# EAGLE design RF Breakout Boards (EAGLE 9.5.1)
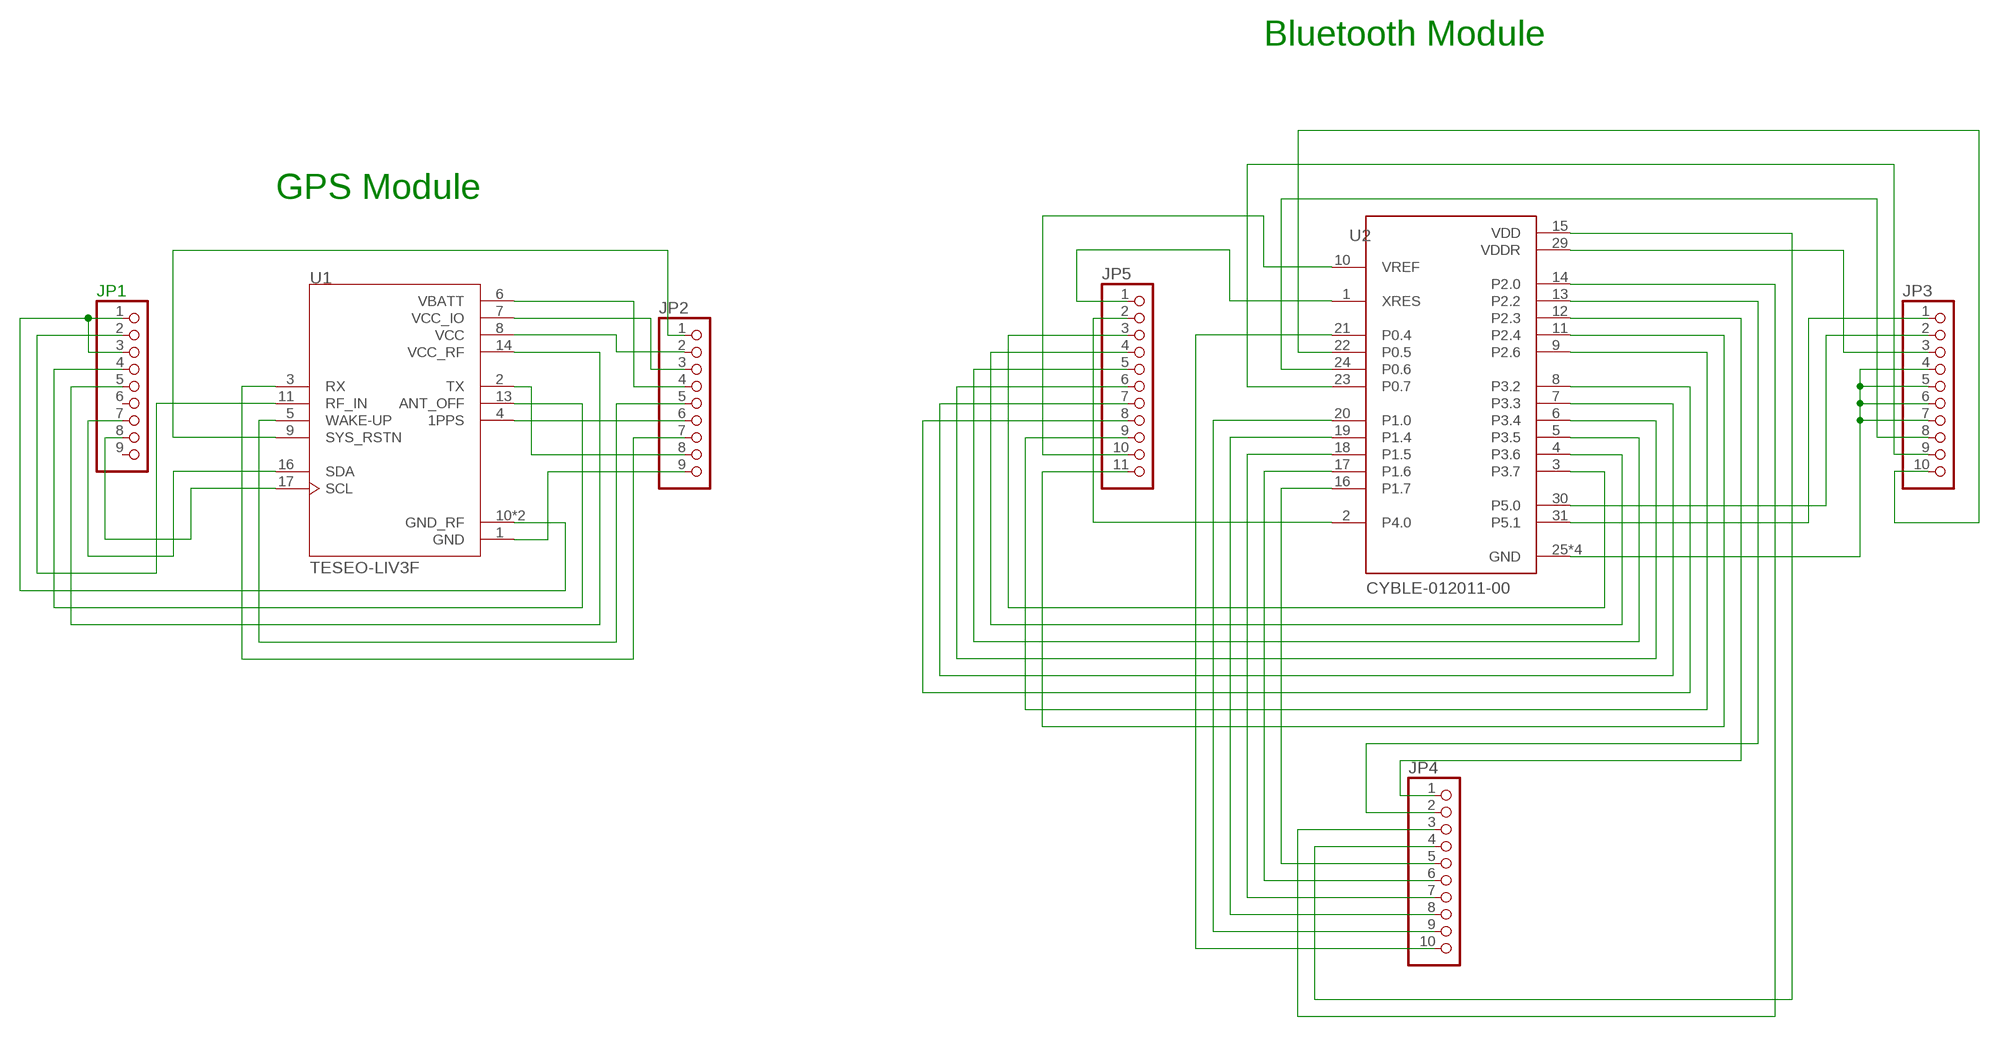
[diagram p0: schematic, sheet 1]

## Parts
JP1  PINHD-1X9  [1X09]
JP2  PINHD-1X9  [1X09]
JP3  PINHD-1X10  [1X10]
JP4  PINHD-1X10  [1X10]
JP5  PINHD-1X11  [1X11]
U1  TESEO-LIV3F  [TESEO-LIV3F]
U2  CYBLE-012011-00  [XCVR_CYBLE-012011-00]

## Nets
1PPS: JP2.6 U1.4(1PPS)
ANT_OFF: JP1.4 U1.13(ANT_OFF)
GND: JP2.9 U1.1(GND)
GND2: JP3.4 JP3.5 JP3.6 JP3.7 U2.25(GND) U2.26(GND) U2.27(GND) U2.28(GND)
GND_RF: JP1.1 JP1.3 U1.10(GND_RF) U1.12(GND_RF)
P0.4: JP4.10 U2.21(P0.4)
P0.5: JP3.10 U2.22(P0.5)
P0.6: JP3.8 U2.24(P0.6)
P0.7: JP3.9 U2.23(P0.7)
P1.0: JP4.9 U2.20(P1.0)
P1.4: JP4.8 U2.19(P1.4)
P1.5: JP4.7 U2.18(P1.5)
P1.6: JP4.6 U2.17(P1.6)
P1.7: JP4.5 U2.16(P1.7)
P2.0: JP4.3 U2.14(P2.0)
P2.2: JP4.2 U2.13(P2.2)
P2.3: JP4.1 U2.12(P2.3)
P2.4: JP5.11 U2.11(P2.4)
P2.6: JP5.9 U2.9(P2.6)
P3.2: JP5.8 U2.8(P3.2)
P3.3: JP5.7 U2.7(P3.3)
P3.4: JP5.6 U2.6(P3.4)
P3.5: JP5.5 U2.5(P3.5)
P3.6: JP5.4 U2.4(P3.6)
P3.7: JP5.3 U2.3(P3.7)
P4.0: JP5.2 U2.2(P4.0)
P5.0: JP3.2 U2.30(P5.0)
P5.1: JP3.1 U2.31(P5.1)
RF_IN: JP1.2 U1.11(RF_IN)
RX: JP2.7 U1.3(RX)
SCL: JP1.8 U1.17(SCL)
SDA: JP1.7 U1.16(SDA)
SYS_RSTN: JP2.1 U1.9(SYS_RSTN)
TX: JP2.8 U1.2(TX)
VBATT: JP2.4 U1.6(VBATT)
VCC: JP2.2 U1.8(VCC)
VCC_IO: JP2.3 U1.7(VCC_IO)
VCC_RF: JP1.5 U1.14(VCC_RF)
VDD: JP4.4 U2.15(VDD)
VDDR: JP3.3 U2.29(VDDR)
VREF: JP5.10 U2.10(VREF)
WAKE-UP: JP2.5 U1.5(WAKE-UP)
XRES: JP5.1 U2.1(XRES)
Unconnected: JP1.6 JP1.9

## Notes on the sheet
- Bluetooth Module
- GPS Module

## Library data of the parts
JP1 JP2 = pinhead:PINHD-1X9: PIN HEADER
JP3 JP4 = pinhead:PINHD-1X10: PIN HEADER
JP5 = pinhead:PINHD-1X11: PIN HEADER
U1 = TESEO-LIV3F:TESEO-LIV3F: Link: https://www.st.com/en/positioning/teseo-liv3f.html; AVAILABILITY: Unavailable; DESCRIPTION: - RF Receiver BeiDou, Galileo, GLONASS, GNSS, GPS 1.575GHz -163dBm 18-LCC _9.7x10.1_; MF: STMicroelectronics; MP: TESEO-LIV3F; PACKAGE: SMD-18 STMicroelectronics; PRICE: None
U2 = CYBLE-012011-00:CYBLE-012011-00: Bluetooth Bluetooth v4.1 Transceiver Module 2.4GHz ~ 2.48GHz Integrated, Trace Surface Mount; AVAILABILITY: Unavailable; DESCRIPTION: Bluetooth Bluetooth v4.1 Transceiver Module 2.4GHz ~ 2.48GHz Integrated, Trace Surface Mount; MF: Cypress Semiconductor; MP: CYBLE-012011-00; PACKAGE: Module Cypress Semiconductor; PRICE: None

## Board
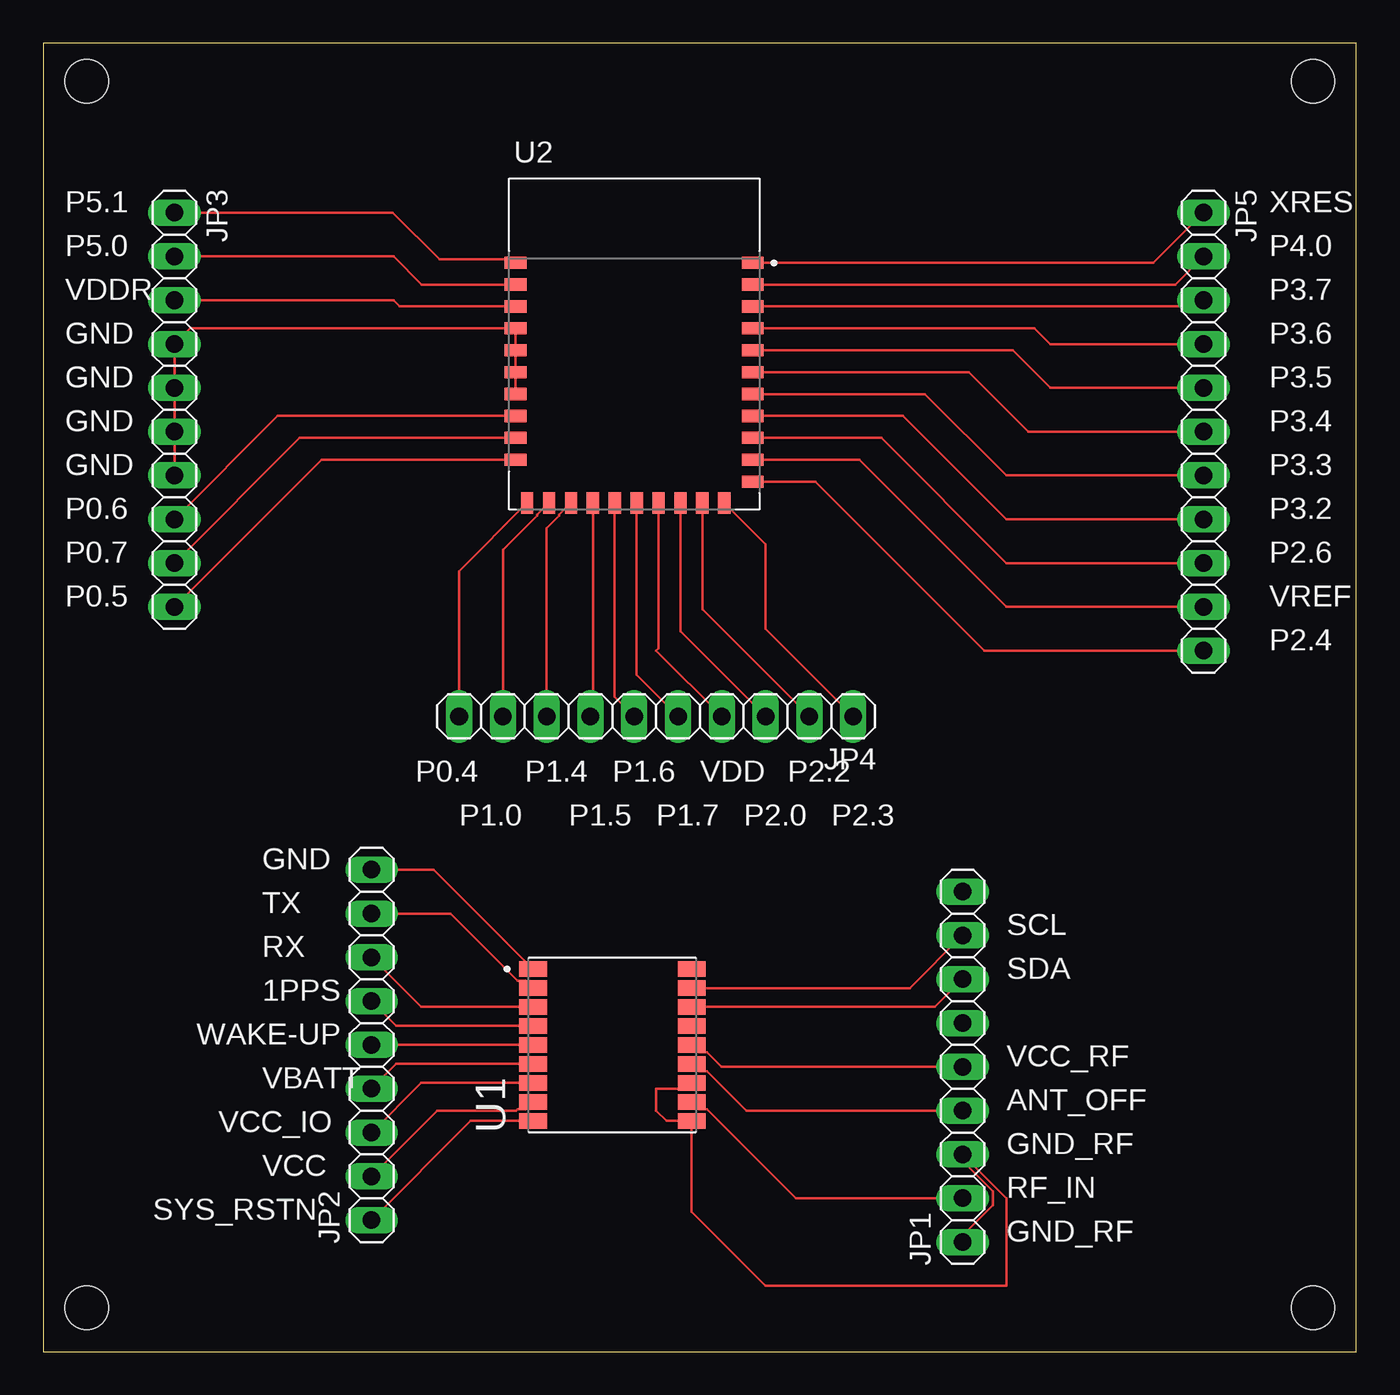
[diagram p1: board, top side]

Size 76.18 x 75.87 mm. Coordinates in mm from the lower left corner, seen from the top.
Outline: 0,0 76.18,0 76.18,75.87 0,75.87 0,0
Copper layers (1*16): Top 0.035mm / dielectric 1.5mm / Bottom 0.035mm
Design rules "default": minimum track width 6mil, minimum drill 0.35mm, track to track 6mil, track to pad 6mil, pad to pad 6mil, via to via 6mil, smd to smd 6mil, copper to edge 40mil, drill to drill 6mil, minimum pad ring 10mil, minimum via ring 8mil, stop-mask expansion 4mil, vias tented up to drill 0mil, thermal gap 10mil
Holes 2.5 mm at 2.54,73.66 2.54,2.54 73.66,2.54 73.66,73.66

### Footprints (pad centres in the part's own frame; a part is rotated, then mirrored left to right if it is on the bottom)
1X09 = drill 1.016 long: 1 -10.16,0; 2 -7.62,0; 3 -5.08,0; 4 -2.54,0; 5 0,0; 6 2.54,0; 7 5.08,0; 8 7.62,0; 9 10.16,0
1X10 = drill 1.016 long: 1 -11.43,0; 2 -8.89,0; 3 -6.35,0; 4 -3.81,0; 5 -1.27,0; 6 1.27,0; 7 3.81,0; 8 6.35,0; 9 8.89,0; 10 11.43,0
1X11 = drill 1.016 long: 1 -12.7,0; 2 -10.16,0; 3 -7.62,0; 4 -5.08,0; 5 -2.54,0; 6 0,0; 7 2.54,0; 8 5.08,0; 9 7.62,0; 10 10.16,0; 11 12.7,0
TESEO-LIV3F = smd 0.9 x 1.6: 1 4.4,4.6; 2 3.3,4.6; 3 2.2,4.6; 4 1.1,4.6; 5 0,4.6; 6 -1.1,4.6; 7 -2.2,4.6; 8 -3.3,4.6; 9 -4.4,4.6; 10 -4.4,-4.6; 11 -3.3,-4.6; 12 -2.2,-4.6; 13 -1.1,-4.6; 14 0,-4.6; 15 1.1,-4.6; 16 2.2,-4.6; 17 3.3,-4.6; 18 4.4,-4.6
XCVR_CYBLE-012011-00 = smd 1.27 x 0.71: 1 6.875,4.72; 2 6.875,3.45; 3 6.875,2.18; 4 6.875,0.91; 5 6.875,-0.36; 6 6.875,-1.63; 7 6.875,-2.9; 8 6.875,-4.17; 9 6.875,-5.44; 10 6.875,-6.71; 11 6.875,-7.98; 22 -6.875,-6.71; 23 -6.875,-5.44; 24 -6.875,-4.17; 25 -6.875,-2.9; 26 -6.875,-1.63; 27 -6.875,-0.36; 28 -6.875,0.91; 29 -6.875,2.18; 30 -6.875,3.45; 31 -6.875,4.72 | smd 0.71 x 1.27: 12 5.22,-9.215; 13 3.95,-9.215; 14 2.68,-9.215; 15 1.41,-9.215; 16 0.14,-9.215; 17 -1.13,-9.215; 18 -2.4,-9.215; 19 -3.67,-9.215; 20 -4.94,-9.215; 21 -6.21,-9.215

### Placement (x,y rotation side)
JP1  53.34,16.51 90 top
JP2  19.05,17.78 90 top
JP3  7.62,54.61 270 top
JP4  35.56,36.83 180 top
JP5  67.31,53.34 270 top
U1  33.02,17.78 90 top
U2  34.29,58.42 0 top

### Tracks (layer width: path | path; a pad name or v marks a point on that pad's centre or on a via)
1PPS
  Top 0.152: U1.4 20.49,18.88 JP2.6
ANT_OFF
  Top 0.152: U1.13 38.04,16.26 38.52,16.26 40.8,13.97 JP1.4
GND
  Top 0.152: U1.1 22.66,27.94 JP2.9
GND2
  Top 0.152: JP3.7 JP3.6 JP3.5 JP3.4 8.53,59.33 U2.28 U2.27 U2.26 U2.25
GND_RF
  Top 0.152: JP1.1 53.34,6.73 55.09,8.48 55.09,9.3 53.34,11.05 JP1.3 55.88,8.89 55.88,3.81 41.91,3.81 37.62,8.1 U1.10 36.15,13.38 35.56,13.97 35.56,15.24 37.28,15.24 U1.12
P0.4
  Top 0.152: U2.21 24.13,45.25 JP4.10
P0.5
  Top 0.152: U2.22 16.15,51.71 JP3.10
P0.6
  Top 0.152: JP3.8 13.61,54.25 U2.24
P0.7
  Top 0.152: U2.23 14.88,52.98 JP3.9
P1.0
  Top 0.152: U2.20 28.66,48.52 28.66,48.47 26.67,46.48 JP4.9
P1.4
  Top 0.152: U2.19 29.93,48.52 29.93,48.47 29.21,47.75 JP4.8
P1.5
  Top 0.152: U2.18 31.89,36.97 JP4.7
P1.6
  Top 0.152: U2.17 33.16,37.96 JP4.6
P1.7
  Top 0.152: U2.16 34.43,39.23 JP4.5
P2.0
  Top 0.152: U2.14 36.97,41.77 JP4.3
P2.2
  Top 0.152: U2.13 38.24,43.04 JP4.2
P2.3
  Top 0.152: U2.12 41.91,46.8 41.91,41.91 JP4.1
P2.4
  Top 0.152: U2.11 44.81,50.44 54.61,40.64 JP5.11
P2.6
  Top 0.152: U2.9 48.62,52.98 55.88,45.72 JP5.9
P3.2
  Top 0.152: U2.8 49.89,54.25 55.88,48.26 JP5.8
P3.3
  Top 0.152: U2.7 51.16,55.52 55.88,50.8 JP5.7
P3.4
  Top 0.152: U2.6 53.7,56.79 57.15,53.34 JP5.6
P3.5
  Top 0.152: U2.5 56.24,58.06 58.42,55.88 JP5.5
P3.6
  Top 0.152: U2.4 57.51,59.33 58.42,58.42 JP5.4
P3.7
  Top 0.152: JP5.3 66.95,60.6 U2.3
P4.0
  Top 0.152: U2.2 65.68,61.87 JP5.2
P5.0
  Top 0.152: U2.30 21.95,61.87 20.32,63.5 JP3.2
P5.1
  Top 0.152: U2.31 27.23,63.32 23,63.32 20.28,66.04 JP3.1
RF_IN
  Top 0.152: U1.11 38.04,14.06 38.52,14.06 43.68,8.89 JP1.2
RX
  Top 0.152: U1.3 21.93,19.98 JP2.7
SCL
  Top 0.152: JP1.8 50.29,21.08 U1.17
SDA
  Top 0.152: U1.16 51.73,19.98 JP1.7
SYS_RSTN
  Top 0.152: JP2.1 24.81,13.38 U1.9
TX
  Top 0.152: U1.2 28,21.5 27.52,21.5 23.63,25.4 JP2.8
VBATT
  Top 0.152: U1.6 20.49,16.68 JP2.4
VCC
  Top 0.152: U1.8 28,14.06 27.52,14.06 27.44,13.97 22.86,13.97 JP2.2
VCC_IO
  Top 0.152: U1.7 21.93,15.58 JP2.3
VCC_RF
  Top 0.152: U1.14 38.04,17.36 38.52,17.36 39.36,16.51 JP1.5
VDD
  Top 0.152: U2.15 35.7,40.78 35.56,40.64 JP4.4
VDDR
  Top 0.152: U2.29 20.68,60.6 20.32,60.96 JP3.3
VREF
  Top 0.152: U2.10 47.35,51.71 55.88,43.18 JP5.10
WAKE-UP
  Top 0.152: U1.5 JP2.5
XRES
  Top 0.152: U2.1 64.41,63.14 JP5.1

### Text on the board
tNames: P5.1 | XRES | P5.0 | P4.0 | VDDR | P3.7 | GND | P3.6 | GND | P3.5 | GND | P3.4 | GND | P3.3 | P0.6 | P3.2 | P0.7 | P2.6 | P0.5 | VREF | P2.4 | P0.4 | P1.4 | P1.6 | VDD | P2.2 | P1.0 | P1.5 | P1.7 | P2.0 | P2.3 | GND | TX | SCL | RX | SDA | 1PPS | WAKE-UP | VCC_RF | VBATT | ANT_OFF | VCC_IO | GND_RF | VCC | RF_IN | SYS_RSTN | GND_RF